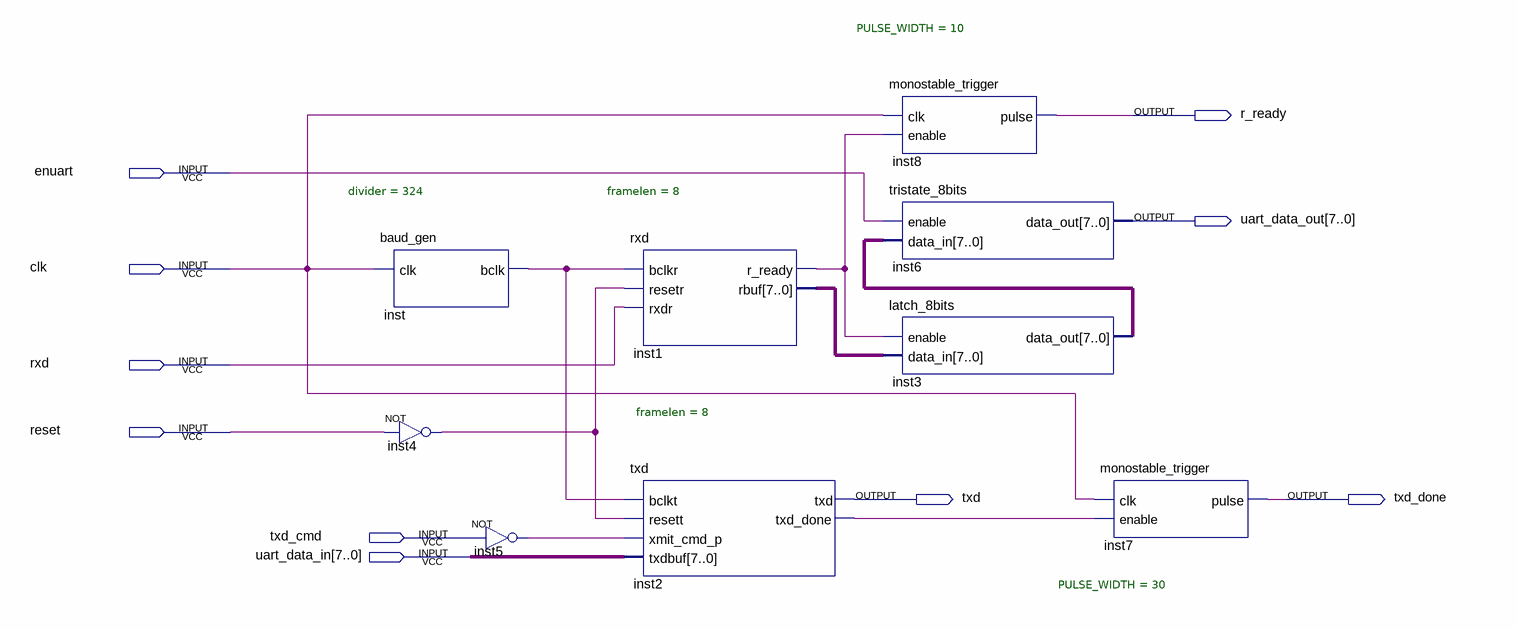
[diagram p0: schematic sheet]
// Quartus schematic uart.bdf as structural Verilog: 9 symbols, 10 pins
module uart (
  input  enuart,
  input  clk,
  input  rxd,
  input  reset,
  input  txd_cmd,
  input  [7:0] uart_data_in,
  output r_ready,
  output [7:0] uart_data_out,
  output txd,
  output txd_done
);

  wire inst1_r_ready, inst2_txd_done, inst4_out, inst5_out, inst_bclk;
  wire [7:0] inst1_rbuf, inst3_data_out;

  baud_gen #(.divider(324)) inst (.clk(clk), .bclk(inst_bclk));
  not inst4 (inst4_out, reset);
  not inst5 (inst5_out, txd_cmd);
  rxd #(.framelen(8)) inst1 (
    .bclkr(inst_bclk), .resetr(inst4_out), .rxdr(rxd), .r_ready(inst1_r_ready), .rbuf(inst1_rbuf));
  txd #(.framelen(8)) inst2 (
    .bclkt(inst_bclk), .resett(inst4_out), .xmit_cmd_p(inst5_out), .txdbuf(uart_data_in), .txd(txd),
    .txd_done(inst2_txd_done));
  monostable_trigger #(.PULSE_WIDTH(10)) inst8 (.clk(clk), .enable(inst1_r_ready), .pulse(r_ready));
  tristate_8bits inst6 (.enable(enuart), .data_in(inst3_data_out), .data_out(uart_data_out));
  latch_8bits inst3 (.enable(inst1_r_ready), .data_in(inst1_rbuf), .data_out(inst3_data_out));
  monostable_trigger #(.PULSE_WIDTH(30)) inst7 (.clk(clk), .enable(inst2_txd_done), .pulse(txd_done));
endmodule
